# Altium schematic sheet DRV8834.SchDoc
size A4; DrawnBy: Lorna Lan, Dylan Vogel; DocumentNumber: 12; Revision: v4.2; SheetNumber: 12; SheetTotal: 20
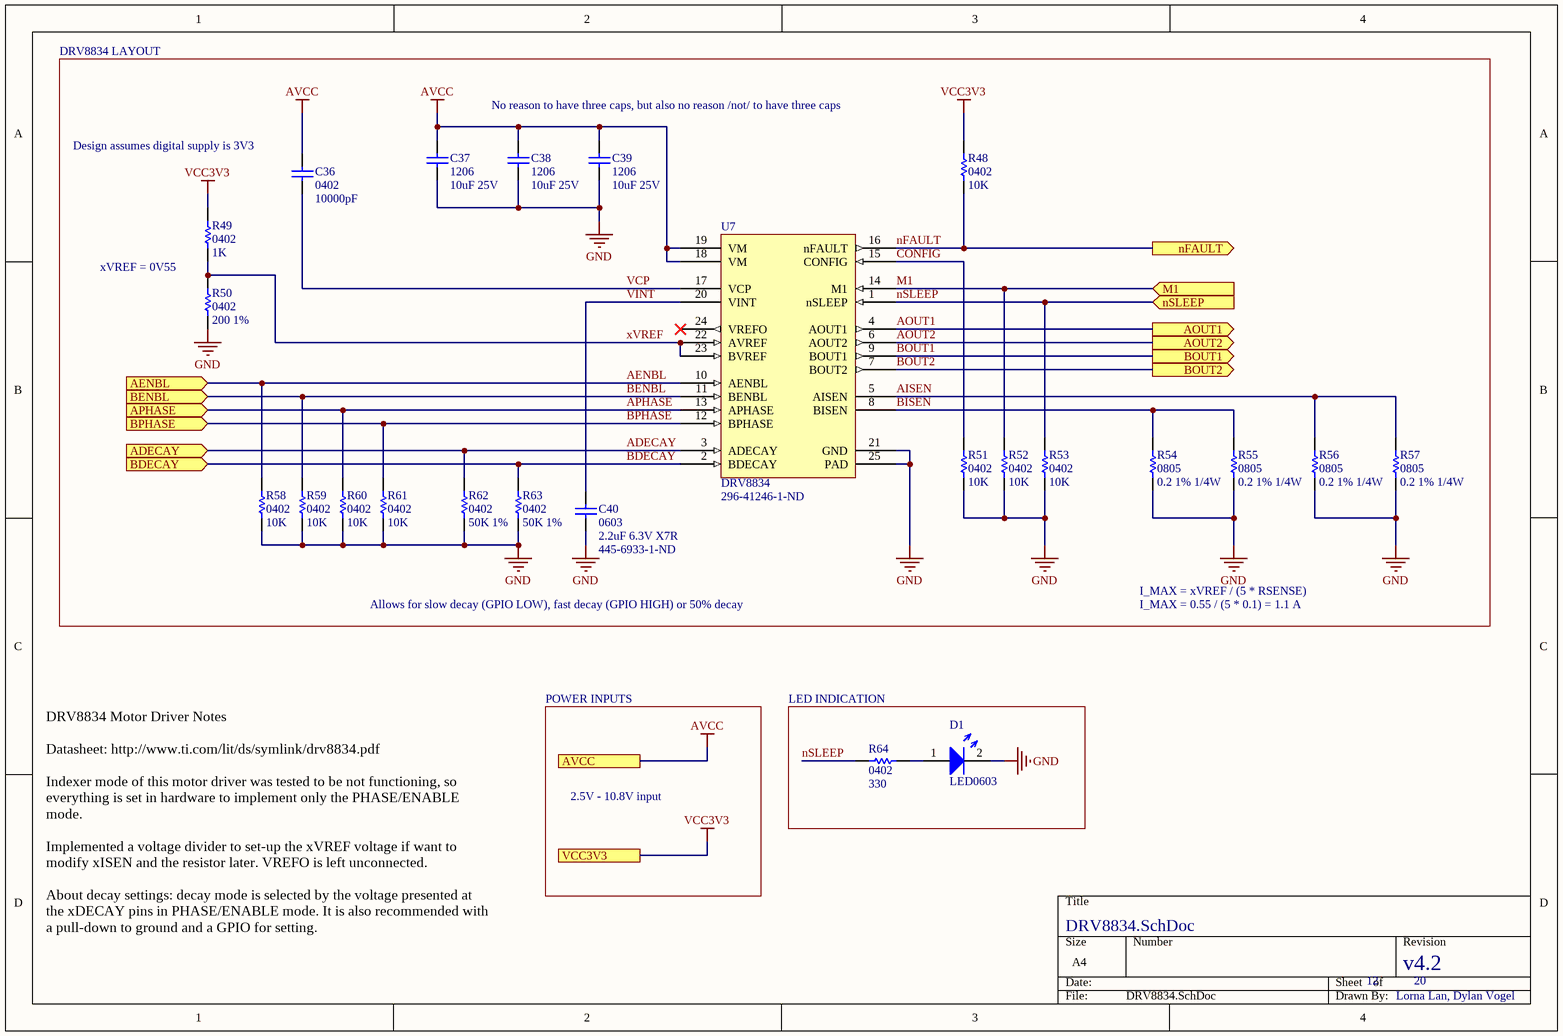
[diagram p0: DRV8834.SchDoc]

## Parts
C36  0402  value 10000pF  [CAP0402R]
C37  1206  value 10uF 25V  [CAP1206R]
C38  1206  value 10uF 25V  [CAP1206R]
C39  1206  value 10uF 25V  [CAP1206R]
C40  0603  value 2.2uF 6.3V X7R  Supplier Part Number 1: 445-6933-1-ND  [CAP0603R]
D1  LED0603  [LED0603]
R48  0402  value 10K  [RES0402R]
R49  0402  value 1K  [RES0402R]
R50  0402  value 200 1%  [RES0402R]
R51  0402  value 10K  [RES0402R]
R52  0402  value 10K  [RES0402R]
R53  0402  value 10K  [RES0402R]
R54  0805  value 0.2 1% 1/4W  [RES0805R]
R55  0805  value 0.2 1% 1/4W  [RES0805R]
R56  0805  value 0.2 1% 1/4W  [RES0805R]
R57  0805  value 0.2 1% 1/4W  [RES0805R]
R58  0402  value 10K  [RES0402R]
R59  0402  value 10K  [RES0402R]
R60  0402  value 10K  [RES0402R]
R61  0402  value 10K  [RES0402R]
R62  0402  value 50K 1%  [RES0402R]
R63  0402  value 50K 1%  [RES0402R]
R64  0402  value 330  [RES0402R]
U7  DRV8834  Supplier Part Number 1: 296-41246-1-ND  [SOP65P640X120-25N]

## Blocks framed on the sheet
LED INDICATION: D1 R64

## Ports
ADECAY (in), AENBL (in), AOUT1 (out), AOUT2 (out), APHASE (in), AVCC, BDECAY (in), BENBL (in), BOUT1 (out), BOUT2 (out), BPHASE (in), M1 (in), nFAULT (out), nSLEEP (in), VCC3V3

## Nets
AVCC: C36.2 C37.2 C38.2 C39.2 U7.18(VM) U7.19(VM) ; port AVCC
GND: C37.1 C38.1 C39.1 C40.2 D1.2 R50.1 R51.2 R52.1 R53.1 R54.1 R55.1 R56.1 R57.1 R58.1 R59.1 R60.1 R61.1 R62.1 R63.1 U7.21(GND) U7.25(PAD)
VCC3V3: R48.2 R49.2 ; port VCC3V3
ADECAY: R62.2 U7.3(ADECAY) ; port ADECAY
AENBL: R58.2 U7.10(AENBL) ; port AENBL
AISEN: R56.2 R57.2 U7.5(AISEN)
AOUT1: U7.4(AOUT1) ; port AOUT1
AOUT2: U7.6(AOUT2) ; port AOUT2
APHASE: R60.2 U7.13(APHASE) ; port APHASE
BDECAY: R63.2 U7.2(BDECAY) ; port BDECAY
BENBL: R59.2 U7.11(BENBL) ; port BENBL
BISEN: R54.2 R55.2 U7.8(BISEN)
BOUT1: U7.9(BOUT1) ; port BOUT1
BOUT2: U7.7(BOUT2) ; port BOUT2
BPHASE: R61.2 U7.12(BPHASE) ; port BPHASE
CONFIG: R51.1 U7.15(CONFIG)
M1: R52.2 U7.14(M1) ; port M1
nFAULT: R48.1 U7.16(nFAULT) ; port nFAULT
nSLEEP: R53.2 R64.2 U7.1(nSLEEP) ; port nSLEEP
VCP: C36.1 U7.17(VCP)
VINT: C40.1 U7.20(VINT)
xVREF: R49.1 R50.2 U7.22(AVREF) U7.23(BVREF)
NetD1_1: D1.1 R64.1

Not connected (* = marked no-connect by the designer): U7 24(VREFO)*

## Notes on the sheet
- DRV8834 LAYOUT
- No reason to have three caps, but also no reason /not/ to have three caps
- (near C36) Design assumes digital supply is 3V3
- xVREF = 0V55
- Allows for slow decay (GPIO LOW), fast decay (GPIO HIGH) or 50% decay
- I_MAX = xVREF / (5 * RSENSE)
- I_MAX = 0.55 / (5 * 0.1) = 1.1 A
- POWER INPUTS
- 2.5V - 10.8V input
- DRV8834 Motor Driver Notes
  Datasheet: http://www.ti.com/lit/ds/symlink/drv8834.pdf
  Indexer mode of this motor driver was tested to be not functioning, so everything is set in hardware to implement only the PHASE/ENABLE mode.
  Implemented a voltage divider to set-up the xVREF voltage if want to modify xISEN and the resistor later. VREFO is left unconnected.
  About decay settings: decay mode is selected by the voltage presented at the xDECAY pins in PHASE/ENABLE mode. It is also recommended with a pull-down to ground and a GPIO for setting.

## Library data of the parts
C36 = Cap: Capacitor; Published: 8-Jun-2000; LatestRevisionDate: 17-Jul-2002; LatestRevisionNote: Re-released for DXP Platform.; PackageReference: RAD-0.3; Publisher: Altium Limited; PackageDescription: Radial Cap, Thru-Hole; 2 Leads; 0.3 in Pin Spacing
C37-C39 = CAP1206: 1206 capacitor; Supplier 1: Digi-Key; Supplier Part Number 1: 445-174428-1-ND
C40 = CAP0603: 0603 capacitor; Supplier 1: Digi-Key
D1 = LED0603: Generic 0603 LED. Use ChipLED from Osram for generic ones.
R48-R53 R58-R63 = RES0402: 0402 resistor
  R49: Supplier 1: Digi-Key; Supplier Part Number 1: YAG1234CT-ND
R54-R57 = RES0805: 0805 resistor; Supplier 1: Digi-Key; Supplier Part Number 1: WSLA-.20CT-ND
R64 = RES0402: 0402 resistor; Manufacturer: TE Connectivity; Manufacturer Part Number: CRGCQ0402F330R; Resistance: 330R; Tolerance: 1%; Max Power Dissipation: 63mW; Temperature Coefficient: 100ppm/°C; Supplier 1: Digi-Key; Supplier Part Number 1: A129621CT-ND; Stock 1: 224275; Pricing 1: 1=0.1, 10=0.022, 100=0.009, 1000=0.00406, 2500=0.00352, 5000=0.00291 (USD); Case/Package: 0402; Case Code (Imperial): 0402; Case Code (Metric): 1005; Min Operating Temperature: -55°C; Max Operating Temperature: 155°C; Composition: Thick Film; Features: Moisture Resistant,Automotive AEC-Q200; Packaging: Tape and Reel; Number of Terminations: 2
U7 = DRV8834: Dual-bridge stepper or dc motor driver. 1.5A per coil with 2.5-10.8 V load supply.; Supplier 1: Digi-Key; ComponentLink1Description: Datasheet; ComponentLink1URL: http://www.ti.com/lit/ds/symlink/drv8834.pdf